# Altium schematic sheet Sensor.SchDoc
size A4; SheetNumber: 4; SheetTotal: 4
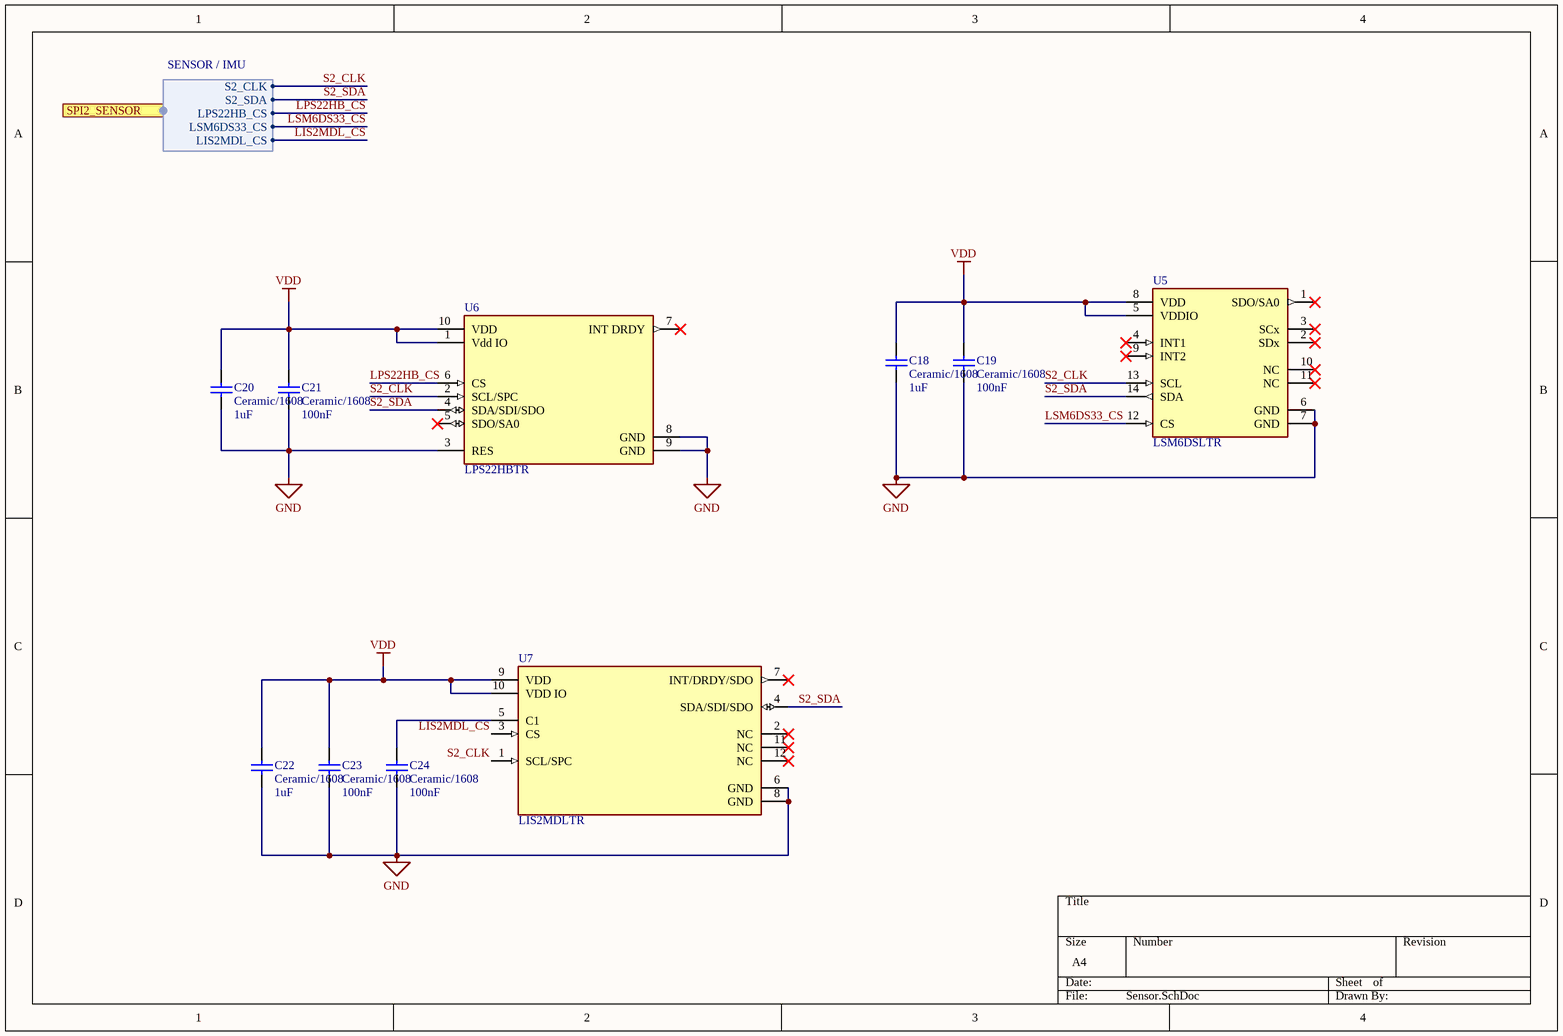
[diagram p0: Sensor.SchDoc]

## Parts
C18  Ceramic/1608  value 1uF  [Generic 1608 Ceramic]
C19  Ceramic/1608  value 100nF  [Generic 1608 Ceramic]
C20  Ceramic/1608  value 1uF  [Generic 1608 Ceramic]
C21  Ceramic/1608  value 100nF  [Generic 1608 Ceramic]
C22  Ceramic/1608  value 1uF  [Generic 1608 Ceramic]
C23  Ceramic/1608  value 100nF  [Generic 1608 Ceramic]
C24  Ceramic/1608  value 100nF  [Generic 1608 Ceramic]
U5  LSM6DSLTR  [FP-LGA-14L-DM00249496-MFG]
U6  LPS22HBTR  [FP-HLGA-10L-8479831-0]
U7  LIS2MDLTR  [FP-LGA-12-DM00170568-MFG]

## Ports
SPI2_SENSOR (harness SENSOR / IMU)

## Harnesses
SENSOR / IMU: LPS22HB_CS, S2_SDA, S2_CLK, LSM6DS33_CS, LIS2MDL_CS

## Nets
GND: C18.1 C19.1 C20.1 C21.1 C22.1 C23.1 C24.2 U5.6(GND) U5.7(GND) U6.3(RES) U6.8(GND) U6.9(GND) U7.6(GND) U7.8(GND)
VDD: C18.2 C19.2 C20.2 C21.2 C22.2 C23.2 U5.5(VDDIO) U5.8(VDD) U6.1(Vdd_IO) U6.10(VDD) U7.9(VDD) U7.10(VDD_IO)
LIS2MDL_CS: U7.3(CS) ; port SPI2_SENSOR.LIS2MDL_CS
LPS22HB_CS: U6.6(CS) ; port SPI2_SENSOR.LPS22HB_CS
LSM6DS33_CS: U5.12(CS) ; port SPI2_SENSOR.LSM6DS33_CS
S2_CLK: U5.13(SCL) U6.2(SCL/SPC) U7.1(SCL/SPC) ; port SPI2_SENSOR.S2_CLK
S2_SDA: U5.14(SDA) U6.4(SDA/SDI/SDO) U7.4(SDA/SDI/SDO) ; port SPI2_SENSOR.S2_SDA
NetC24_1: C24.1 U7.5(C1)

Not connected (* = marked no-connect by the designer): U5 1(SDO/SA0)* 2(SDx)* 3(SCx)* 4(INT1)* 9(INT2)* 10(NC)* 11(NC)*; U6 5(SDO/SA0)* 7(INT_DRDY)*; U7 2(NC)* 7(INT/DRDY/SDO)* 11(NC)* 12(NC)*

## Library data of the parts
C18-C24 = CMP-002-0009-3: Generic 1608 Ceramic Capacitor; Capacitor Type: Ceramic; Pins: 2; Mount: SMD; Case/Package: 1608; RoHS: Yes
U5 = CMP-2000-07467-2: IMU ACCEL/GYRO I2C/SPI 14LGA; Manufacturer: STMicroelectronics; Resolution: 16bits; Max Supply Voltage: 3.6V; Sensor Type: Temperature,Accelerometer,Gyroscope; Sensor Output: I2C,SPI; Gyro Range: 125/250/500/1000/2000°/s; Accel Range: 2/4/8/16g; Operating Supply Current: 0.29-0.65mA; Min Supply Voltage: 1.62V; Package: LGA-14L-DM00249496; Temperature Range High: +85°C; Automotive: No; Footprint Url: https://www.st.com/resource/en/technical_note/cd00134799.pdf; Height: 0.86mm; Device Class L1: Sensors; Octopart: https://octopart.com/lsm6dsltr-stmicroelectronics-66358193; Device Class L2: Motion Sensors; Lead Free: Yes; Category: IC; Device Class L3: Inertial Measurement Units (IMUs); ComponentLink2Description: Datasheet; RoHS: TRUE; ComponentLink2URL: https://www.st.com/resource/en/datasheet/lsm6dsl.pdf; Temperature Range Low: -40°C; Manufacturer Part Number: LSM6DSLTR; Mouser Description: iNEMO inertial module: always-on 3D accelerometer and 3D gyroscope; Digikey Description: IMU ACCEL/GYRO I2C/SPI 14LGA; Temperature: -40°C to +85°C
U6 = CMP-12182-000004-1: MEMS NANO PRESSURE SENSOR: 260-1; Manufacturer: STMicroelectronics; Sensor Output: I2C,SPI; Port Style: No Port; Max Supply Voltage: 3.6V; Operating Supply Current: 3-12uA; Min Supply Voltage: 1.7V; Device Class L3: unset; Device Class L1: Sensors; Manufacturer Part Number: LPS22HBTR; Temperature Range High: +85°C; Digikey Description: MEMS NANO PRESSURE SENSOR: 260-1; Device Class L2: Pressure Sensors; RoHS: TRUE; Lead Free: Yes; Height: 0.8mm; Automotive: No; Octopart: https://octopart.com/lps22hbtr-stmicroelectronics-51851131; Package: HLGA-10L-8479831; Temperature Range Low: -40°C; Category: IC; Temperature: -40°C to +85°C; ComponentLink2Description: Datasheet; ComponentLink2URL: https://www.st.com/resource/en/datasheet/lps22hb.pdf; Footprint Url: https://www.st.com/content/ccc/resource/technical/document/technical_note/73/17/9c/16/dd/96/4a/01/CD00134799.pdf/files/CD00134799.pdf/jcr:content/translations/en.CD00134799.pdf
U7 = CMP-12173-000002-1: SENSOR MR I2C/SPI 12LGA; Manufacturer: STMicroelectronics; Sensing Method: Magnetic; Min Supply Voltage: 1.71V; Sensor Output: I2C,SPI; Operating Supply Current: 50-200uA; Max Supply Voltage: 3.6V; Octopart: https://octopart.com/lis2mdltr-stmicroelectronics-81117311; RoHS: TRUE; Device Class L3: unset; Device Class L1: Sensors; ComponentLink2URL: https://www.st.com/resource/en/datasheet/lis2mdl.pdf; Automotive: No; Device Class L2: Magnetic Sensors; Lead Free: Yes; Temperature: -40°C to +85°C; Manufacturer Part Number: LIS2MDLTR; Temperature Range High: +85°C; Height: 0.7mm; Digikey Description: SENSOR MR I2C/SPI 12LGA; Category: IC; ComponentLink2Description: Datasheet; Package: LGA-12-DM00170568; Temperature Range Low: -40°C